# Altium project G-03T AI Board V1.0.PrjPcb
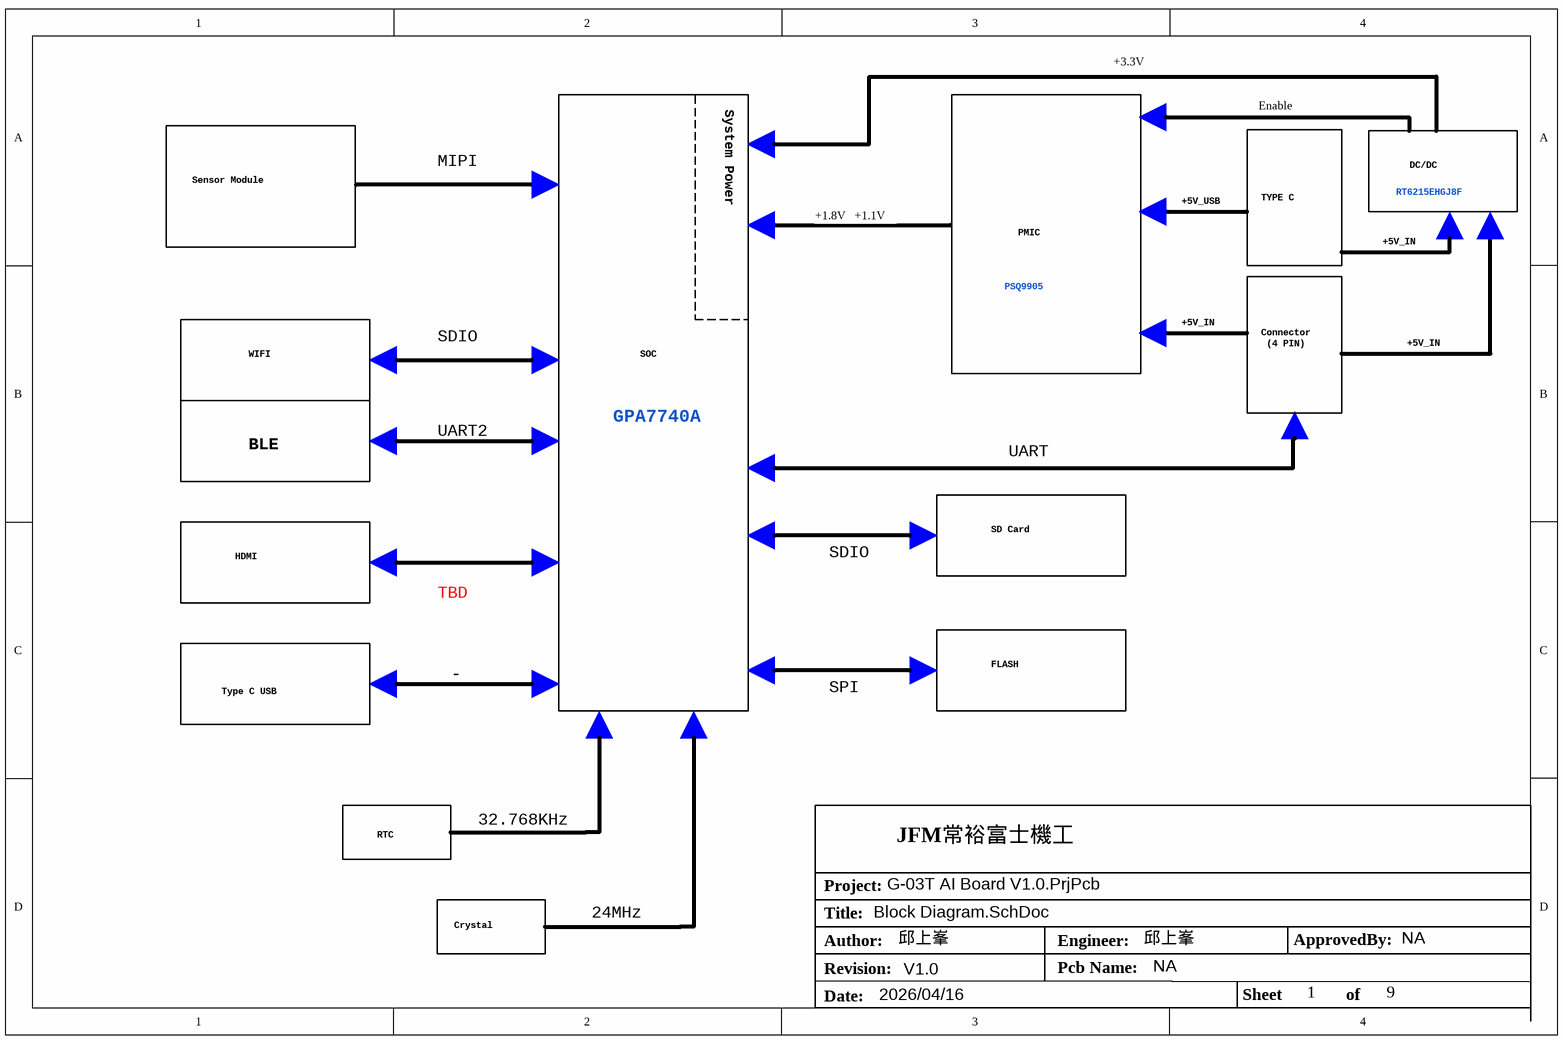
[diagram p0: Block Diagram.SchDoc]
9 sheets, 122 parts. Net scope: global (net labels, ports and power ports of the same name join across sheets).
Board file: G-03T AI Board V1.0_0416.PcbDoc
Sheets:
  Block Diagram.SchDoc
  Power Flow.SchDoc
  CPU.SchDoc
  Peripheral Interface.SchDoc
  FLASH.SchDoc
  Micro SD-Card . USB2.0.SchDoc
  Pmic.SchDoc
  DC Converter.SchDoc
  Change Note.SchDoc

## Sheet Block Diagram.SchDoc
size A4; Date: 2026/04/16; ApprovedBy: NA; Author: 邱上峯; CompanyName: JFM常裕富士機工; Engineer: 邱上峯; Revision: V1.0; SheetNumber: 1; SheetTotal: 9; Pcb Name: NA

### Notes on the sheet
- System Power
- +3.3V
- Enable
- MIPI
- Sensor Module
- +1.8V   +1.1V
- PMIC
- +5V_USB
- TYPE C
- +5V_IN
- RT6215EHGJ8F
- DC/DC
- PSQ9905
- WIFI
- SDIO
- SOC
- Connector
  (4 PIN)
- BLE
- UART2
- GPA7740A
- UART
- HDMI
- SD Card
- TBD
- Type C USB
- -
- SPI
- FLASH
- RTC
- 32.768KHz
- 24MHz
- Crystal
- Title:
- Project:
- Date:
- Author:
- Revision:
- Engineer:
- Pcb Name:
- Sheet
- ApprovedBy:
- of

## Sheet Power Flow.SchDoc
size A3; Date: 2026/04/16; ApprovedBy: NA; Author: 邱上峯; CompanyName: JFM常裕富士機工; Engineer: 邱上峯; Revision: V1.0; SheetNumber: 2; SheetTotal: 9; Pcb Name: NA
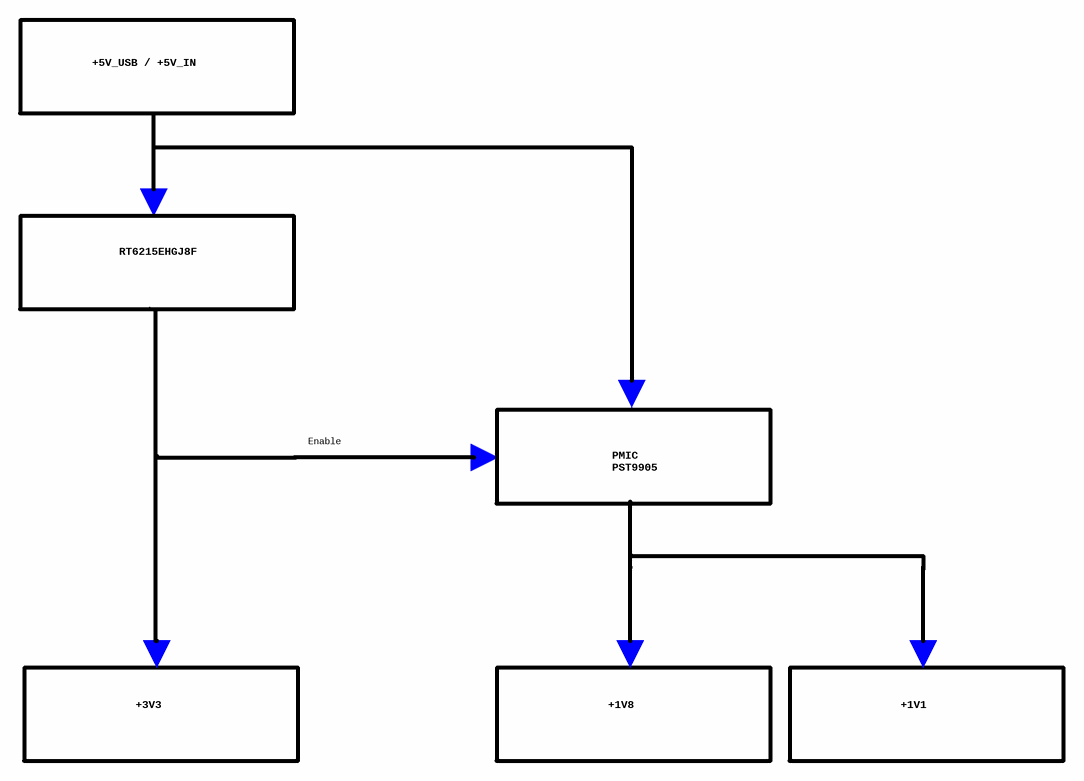
[diagram p1: Power Flow.SchDoc]

### Notes on the sheet
- +5V_USB / +5V_IN
- RT6215EHGJ8F
- Enable
- PMIC
  PST9905
- +3V3
- +1V8
- +1V1
- Title:
- Project:
- Date:
- Author:
- Revision:
- Engineer:
- Pcb Name:
- Sheet
- ApprovedBy:
- of

## Sheet CPU.SchDoc
size A3; Date: 2026/04/16; ApprovedBy: NA; Author: 邱上峯; CompanyName: JFM常裕富士機工; Engineer: 邱上峯; Revision: V1.0; SheetNumber: 2; SheetTotal: 8; Pcb Name: NA
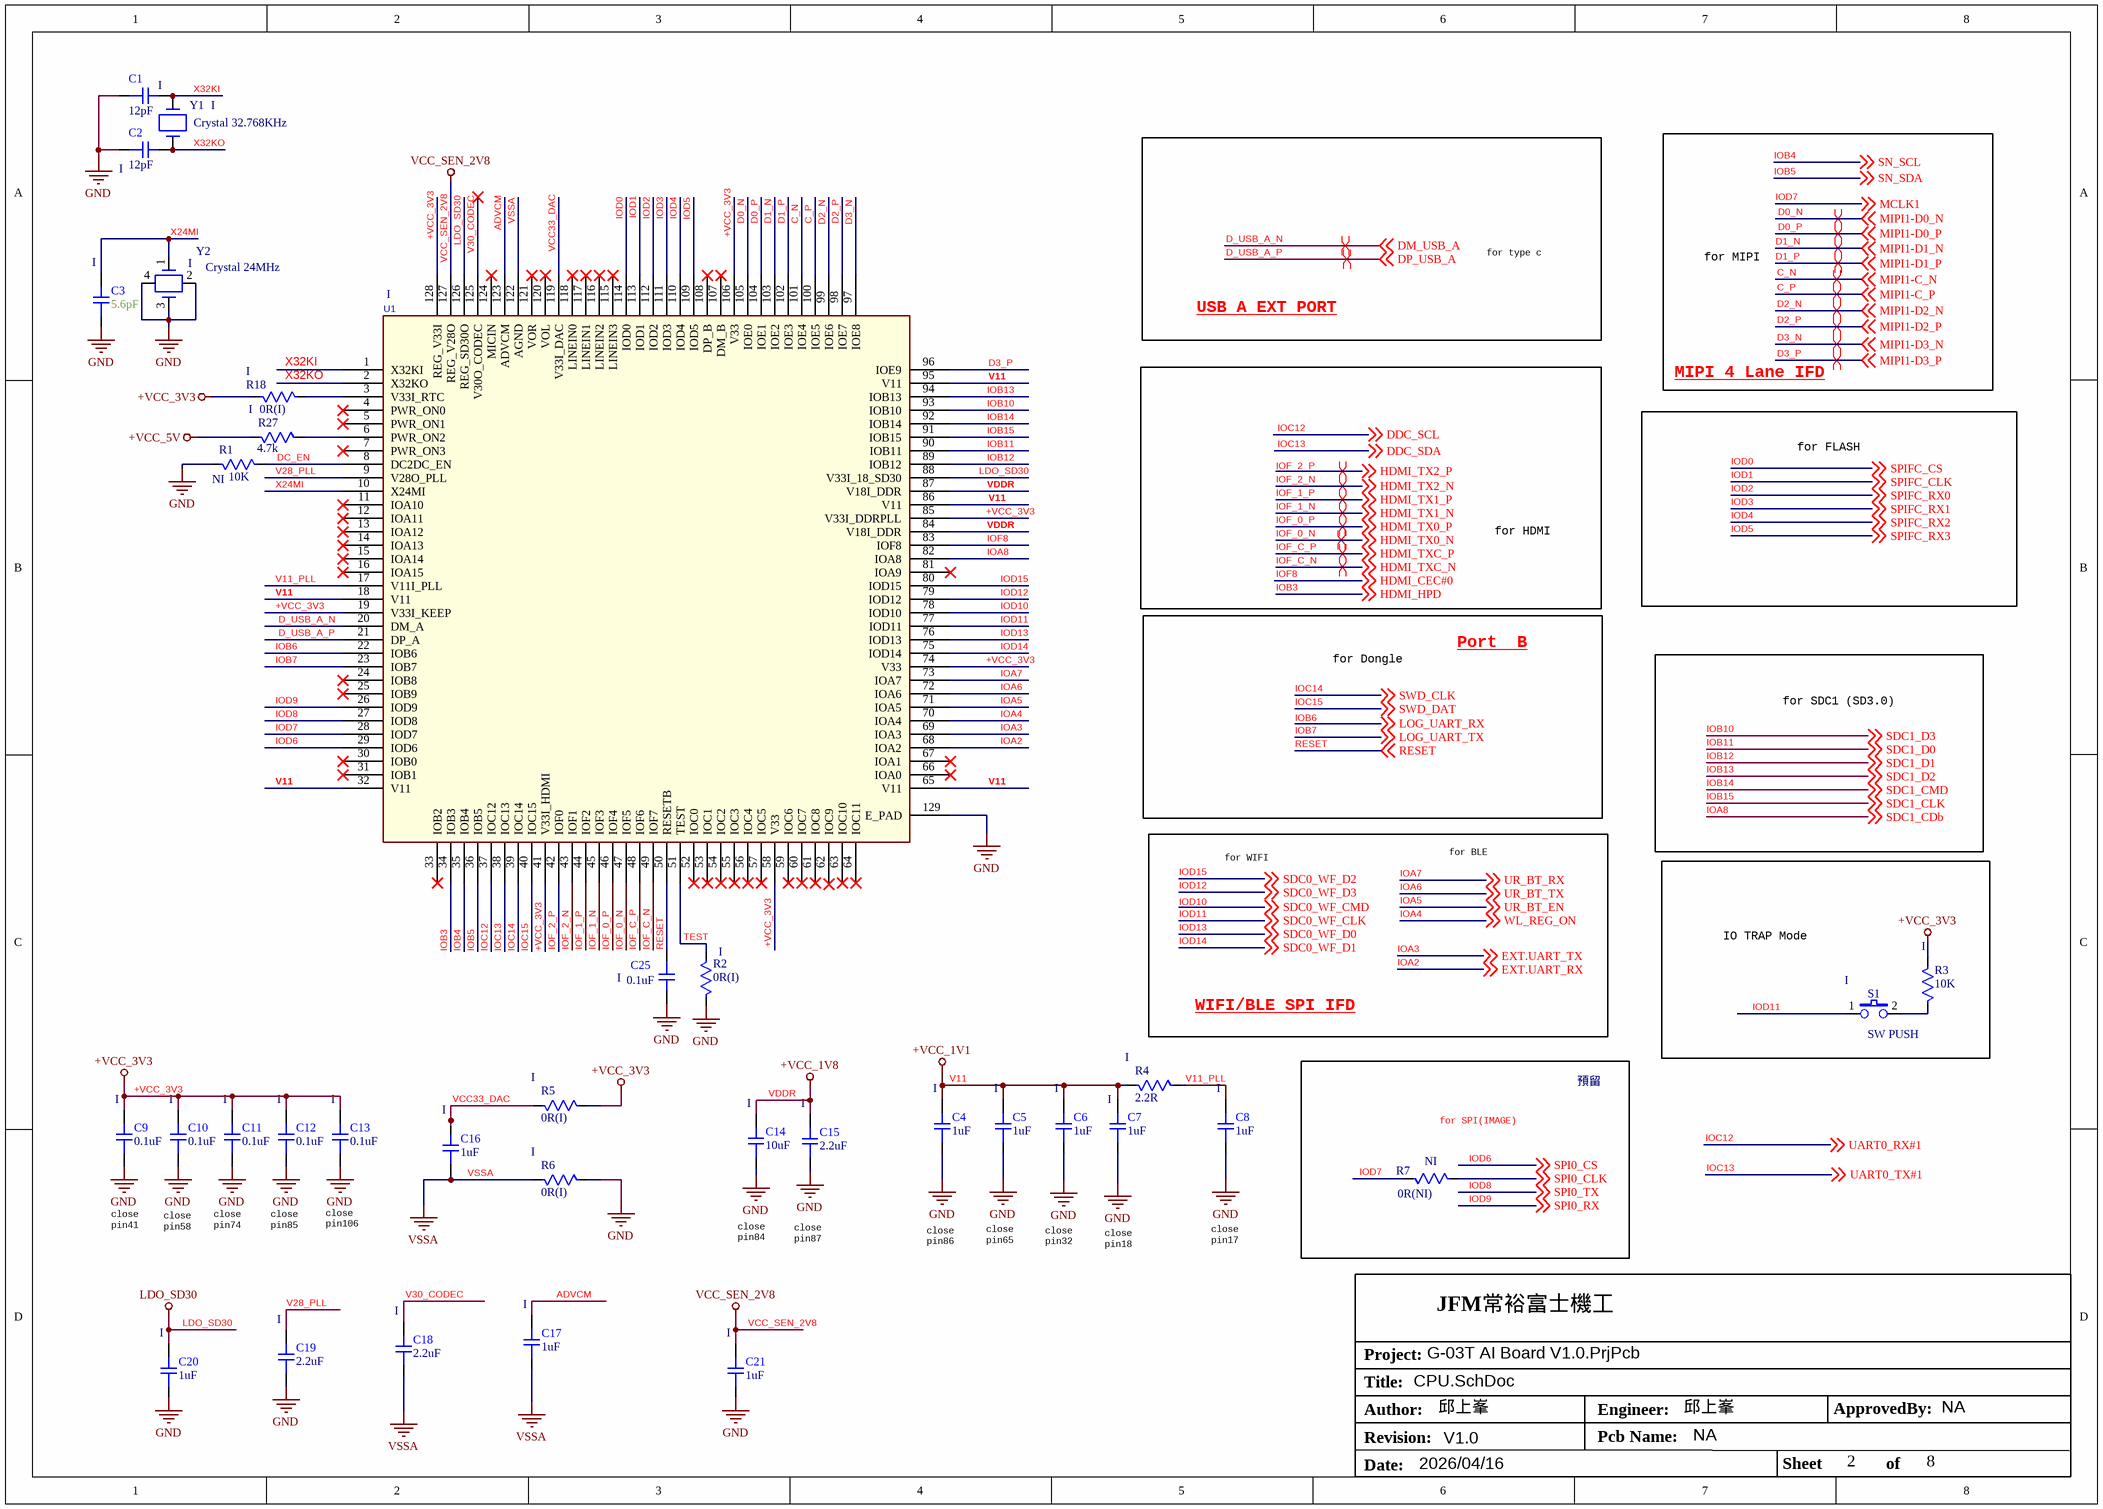
[diagram p2: CPU.SchDoc]

### Parts
C1  12pF  BOM: I  [C0402]
C2  12pF  BOM: I  [C0402]
C3  5.6pF  BOM: I  [C0402]
C4  1uF  BOM: I  [C0402]
C5  1uF  BOM: I  [C0402]
C6  1uF  BOM: I  [C0402]
C7  1uF  BOM: I  [C0402]
C8  1uF  BOM: I  [C0402]
C9  0.1uF  BOM: I  [C0402]
C10  0.1uF  BOM: I  [C0402]
C11  0.1uF  BOM: I  [C0402]
C12  0.1uF  BOM: I  [C0402]
C13  0.1uF  BOM: I  [C0402]
C14  10uF  BOM: I  [C0603]
C15  2.2uF  BOM: I  [C0402]
C16  1uF  BOM: I  [C0402]
C17  1uF  BOM: I  [C0402]
C18  2.2uF  BOM: I  [C0402]
C19  2.2uF  BOM: I  [C0402]
C20  1uF  BOM: I  [C0402]
C21  1uF  BOM: I  [C0402]
C25  0.1uF  BOM: I  [C0402]
R1  10K  BOM: NI  [R0603]
R2  0R(I)  BOM: I  [R0402]
R3  10K  BOM: I  [R0402]
R4  2.2R  BOM: I  [R0603]
R5  0R(I)  BOM: I  [R0402]
R6  0R(I)  BOM: I  [R0402]
R7  0R(NI)  BOM: NI  [R0402]
R18  0R(I)  BOM: I  [R0402]
R27  4.7k  BOM: I  [R0402]
S1  SW PUSH  BOM: I  [Surface Mount Right Angle Switch]
U1  BOM: I  [TQFP128P 1600X1600X160-129N]  (hidden comment: GPA7740A-LQFP128-EP)
Y1  Crystal 32.768KHz  BOM: I  [Crystal 32.768KHz]
Y2  Crystal 24MHz  BOM: I  [Crystal 24MHz]

### Blocks framed on the sheet
IO TRAP Mode: R3 S1
預留: R7

### Nets
+VCC_3V3: C9.2 C10.2 C11.2 C12.2 C13.2 R3.1 R5.2 R18.2 U1.19(V33I_KEEP) U1.41(V33I_HDMI) U1.58(V33) U1.74(V33) U1.85(V33I_DDRPLL) U1.106(V33) U1.128(REG_V33I)
+VCC_5V: R27.2
GND: C1.1 C2.1 C3.1 C4.1 C5.1 C6.1 C7.1 C8.1 C9.1 C10.1 C11.1 C12.1 C13.1 C14.1 C15.1 C19.1 C20.1 C21.1 C25.2 R1.2 R2.1 R6.2 U1.129(E_PAD) Y2.2 Y2.3 Y2.4
LDO_SD30: C20.2 U1.88(V33I_18_SD30) U1.126(REG_SD30O)
V11: C4.2 C5.2 C6.2 C7.2 R4.1 U1.18(V11) U1.32(V11) U1.65(V11) U1.86(V11) U1.95(V11)  [also labelled +VCC_1V1]
VCC_SEN_2V8: C21.2 U1.127(REG_V28O)
VDDR: C14.2 C15.2 U1.84(V18I_DDR) U1.87(V18I_DDR)  [also labelled +VCC_1V8]
VSSA: C16.1 C17.1 C18.1 R6.1 U1.122(AGND)
ADVCM: C17.2 U1.123(ADVCM)
C_N: U1.101(IOE4) ; off-sheet MIPI1-C_N  [also labelled MIPI1-C_N]
C_P: U1.100(IOE5) ; off-sheet MIPI1-C_P  [also labelled MIPI1-C_P]
D0_N: U1.105(IOE0) ; off-sheet MIPI1-D0_N  [also labelled MIPI1-D0_N]
D0_P: U1.104(IOE1) ; off-sheet MIPI1-D0_P  [also labelled MIPI1-D0_P]
D1_N: U1.103(IOE2) ; off-sheet MIPI1-D1_N  [also labelled MIPI1-D1_N]
D1_P: U1.102(IOE3) ; off-sheet MIPI1-D1_P  [also labelled MIPI1-D1_P]
D2_N: U1.99(IOE6) ; off-sheet MIPI1-D2_N  [also labelled MIPI1-D2_N]
D2_P: U1.98(IOE7) ; off-sheet MIPI1-D2_P  [also labelled MIPI1-D2_P]
D3_N: U1.97(IOE8) ; off-sheet MIPI1-D3_N  [also labelled MIPI1-D3_N]
D3_P: U1.96(IOE9) ; off-sheet MIPI1-D3_P  [also labelled MIPI1-D3_P]
D_USB_A_N: U1.20(DM_A) ; off-sheet DM_USB_A  [also labelled DM_USB_A]
D_USB_A_P: U1.21(DP_A) ; off-sheet DP_USB_A  [also labelled DP_USB_A]
DC_EN: R1.1 U1.8(DC2DC_EN)
IOA2: U1.68(IOA2) ; off-sheet EXT.UART_RX  [also labelled EXT.UART_RX]
IOA3: U1.69(IOA3) ; off-sheet EXT.UART_TX  [also labelled EXT.UART_TX]
IOA4: U1.70(IOA4) ; off-sheet WL_REG_ON  [also labelled WL_REG_ON]
IOA5: U1.71(IOA5) ; off-sheet UR_BT_EN  [also labelled UR_BT_EN]
IOA6: U1.72(IOA6) ; off-sheet UR_BT_TX  [also labelled UR_BT_TX]
IOA7: U1.73(IOA7) ; off-sheet UR_BT_RX  [also labelled UR_BT_RX]
IOA8: U1.82(IOA8) ; off-sheet SDC1_CDb  [also labelled SDC1_CDb]
IOB3: U1.34(IOB3) ; off-sheet HDMI_HPD  [also labelled HDMI_HPD]
IOB4: U1.35(IOB4) ; off-sheet SN_SCL  [also labelled SN_SCL]
IOB5: U1.36(IOB5) ; off-sheet SN_SDA  [also labelled SN_SDA]
IOB6: U1.22(IOB6) ; off-sheet LOG_UART_RX  [also labelled LOG_UART_RX]
IOB7: U1.23(IOB7) ; off-sheet LOG_UART_TX  [also labelled LOG_UART_TX]
IOB10: U1.93(IOB10) ; off-sheet SDC1_D3  [also labelled SDC1_D3]
IOB11: U1.90(IOB11) ; off-sheet SDC1_D0  [also labelled SDC1_D0]
IOB12: U1.89(IOB12) ; off-sheet SDC1_D1  [also labelled SDC1_D1]
IOB13: U1.94(IOB13) ; off-sheet SDC1_D2  [also labelled SDC1_D2]
IOB14: U1.92(IOB14) ; off-sheet SDC1_CMD  [also labelled SDC1_CMD]
IOB15: U1.91(IOB15) ; off-sheet SDC1_CLK  [also labelled SDC1_CLK]
IOC12: U1.37(IOC12) ; off-sheet DDC_SCL, off-sheet UART0_RX#1  [also labelled DDC_SCL, UART0_RX#1]
IOC13: U1.38(IOC13) ; off-sheet DDC_SDA, off-sheet UART0_TX#1  [also labelled DDC_SDA, UART0_TX#1]
IOC14: U1.39(IOC14) ; off-sheet SWD_CLK  [also labelled SWD_CLK]
IOC15: U1.40(IOC15) ; off-sheet SWD_DAT  [also labelled SWD_DAT]
IOD0: U1.114(IOD0) ; off-sheet SPIFC_CS  [also labelled SPIFC_CS]
IOD1: U1.113(IOD1) ; off-sheet SPIFC_CLK  [also labelled SPIFC_CLK]
IOD2: U1.112(IOD2) ; off-sheet SPIFC_RX0  [also labelled SPIFC_RX0]
IOD3: U1.111(IOD3) ; off-sheet SPIFC_RX1  [also labelled SPIFC_RX1]
IOD4: U1.110(IOD4) ; off-sheet SPIFC_RX2  [also labelled SPIFC_RX2]
IOD5: U1.109(IOD5) ; off-sheet SPIFC_RX3  [also labelled SPIFC_RX3]
IOD6: U1.29(IOD6) ; off-sheet SPI0_CS  [also labelled SPI0_CS]
IOD7: R7.1 U1.28(IOD7) ; off-sheet MCLK1  [also labelled MCLK1]
IOD8: U1.27(IOD8) ; off-sheet SPI0_TX  [also labelled SPI0_TX]
IOD9: U1.26(IOD9) ; off-sheet SPI0_RX  [also labelled SPI0_RX]
IOD10: U1.78(IOD10) ; off-sheet SDC0_WF_CMD  [also labelled SDC0_WF_CMD]
IOD11: S1.1 U1.77(IOD11) ; off-sheet SDC0_WF_CLK  [also labelled SDC0_WF_CLK]
IOD12: U1.79(IOD12) ; off-sheet SDC0_WF_D3  [also labelled SDC0_WF_D3]
IOD13: U1.76(IOD13) ; off-sheet SDC0_WF_D0  [also labelled SDC0_WF_D0]
IOD14: U1.75(IOD14) ; off-sheet SDC0_WF_D1  [also labelled SDC0_WF_D1]
IOD15: U1.80(IOD15) ; off-sheet SDC0_WF_D2  [also labelled SDC0_WF_D2]
IOF8: U1.83(IOF8) ; off-sheet HDMI_CEC#0  [also labelled HDMI_CEC#0]
IOF_0_N: U1.47(IOF5) ; off-sheet HDMI_TX0_N  [also labelled HDMI_TX0_N]
IOF_0_P: U1.46(IOF4) ; off-sheet HDMI_TX0_P  [also labelled HDMI_TX0_P]
IOF_1_N: U1.45(IOF3) ; off-sheet HDMI_TX1_N  [also labelled HDMI_TX1_N]
IOF_1_P: U1.44(IOF2) ; off-sheet HDMI_TX1_P  [also labelled HDMI_TX1_P]
IOF_2_N: U1.43(IOF1) ; off-sheet HDMI_TX2_N  [also labelled HDMI_TX2_N]
IOF_2_P: U1.42(IOF0) ; off-sheet HDMI_TX2_P  [also labelled HDMI_TX2_P]
IOF_C_N: U1.49(IOF7) ; off-sheet HDMI_TXC_N  [also labelled HDMI_TXC_N]
IOF_C_P: U1.48(IOF6) ; off-sheet HDMI_TXC_P  [also labelled HDMI_TXC_P]
RESET: C25.1 U1.50(RESETB) ; off-sheet RESET
SPI0_CLK: R7.2 ; off-sheet SPI0_CLK
TEST: R2.2 U1.51(TEST)
V11_PLL: C8.2 R4.2 U1.17(V11I_PLL)
V28_PLL: C19.2 U1.9(V28O_PLL)
V30_CODEC: C18.2 U1.125(V30O_CODEC)
VCC33_DAC: C16.2 R5.1 U1.119(V33I_DAC)
X24MI: C3.2 U1.10(X24MI) Y2.1
X32KI: C1.2 U1.1(X32KI) Y1.2
X32KO: C2.2 U1.2(X32KO) Y1.1
NetR3_2: R3.2 S1.2
NetR18_1: R18.1 U1.3(V33I_RTC)
NetR27_1: R27.1 U1.6(PWR_ON2)

Not connected (* = marked no-connect by the designer): U1 4(PWR_ON0)* 5(PWR_ON1)* 7(PWR_ON3)* 11(IOA10)* 12(IOA11)* 13(IOA12)* 14(IOA13)* 15(IOA14)* 16(IOA15)* 24(IOB8)* 25(IOB9)* 30(IOB0)* 31(IOB1)* 33(IOB2)* 52(IOC0)* 53(IOC1)* 54(IOC2)* 55(IOC3)* 56(IOC4)* 57(IOC5)* 59(IOC6)* 60(IOC7)* 61(IOC8)* 62(IOC9) 63(IOC10)* 64(IOC11)* 66(IOA0)* 67(IOA1)* 81(IOA9)* 107(DM_B)* 108(DP_B)* 115(LINEIN3)* 116(LINEIN2)* 117(LINEIN1)* 118(LINEIN0)* 120(VOL)* 121(VOR)* 124(MICIN)*

### Layout directives
differential pair: C_N, C_P, D0_N, D0_P, D1_N, D1_P, D2_N, D2_P, D3_N, D3_P, D_USB_A_N, D_USB_A_P, IOF_0_N, IOF_0_P, IOF_1_N, IOF_1_P, IOF_2_N, IOF_2_P, IOF_C_N, IOF_C_P

### Notes on the sheet
- USB A EXT PORT
- for type c
- for MIPI
- MIPI 4 Lane IFD
- for FLASH
- for HDMI
- Port  B
- for Dongle
- for SDC1 (SD3.0)
- for BLE
- for WIFI
- WIFI/BLE SPI IFD
- (near R7) for SPI(IMAGE)
- close
  pin41
- close
  pin58
- close
  pin74
- close
  pin85
- close
  pin106
- close
  pin84
- close
  pin87
- close
  pin86
- close
  pin65
- close
  pin32
- close
  pin18
- close
  pin17
- Labels drawn without touching a wire or pin: IOB6, IOD10, IOF_2_P
- Title:
- Project:
- Date:
- Author:
- Revision:
- Engineer:
- Pcb Name:
- Sheet
- ApprovedBy:
- of

### Library data of the parts
C1-C21 C25 = Cap
R1-R7 R18 R27 = Res
Y1 = Crystal 32.768KHz: Q-SC20S03220C5AAAF,SEIKO,l32.768KHz,12.5PF,20ppm,2.05x1.2mm
Y2 = Crystal 24MHz: XRCGE24M000FBA1BR0,MURATA,24.0000MHZ,8PF,15PPM,2.0x1.6mm

## Sheet Peripheral Interface.SchDoc
size A3; Date: 2026/04/16; ApprovedBy: NA; Author: 邱上峯; CompanyName: JFM常裕富士機工; Engineer: 邱上峯; Revision: V1.0; SheetNumber: 3; SheetTotal: 8; Pcb Name: NA
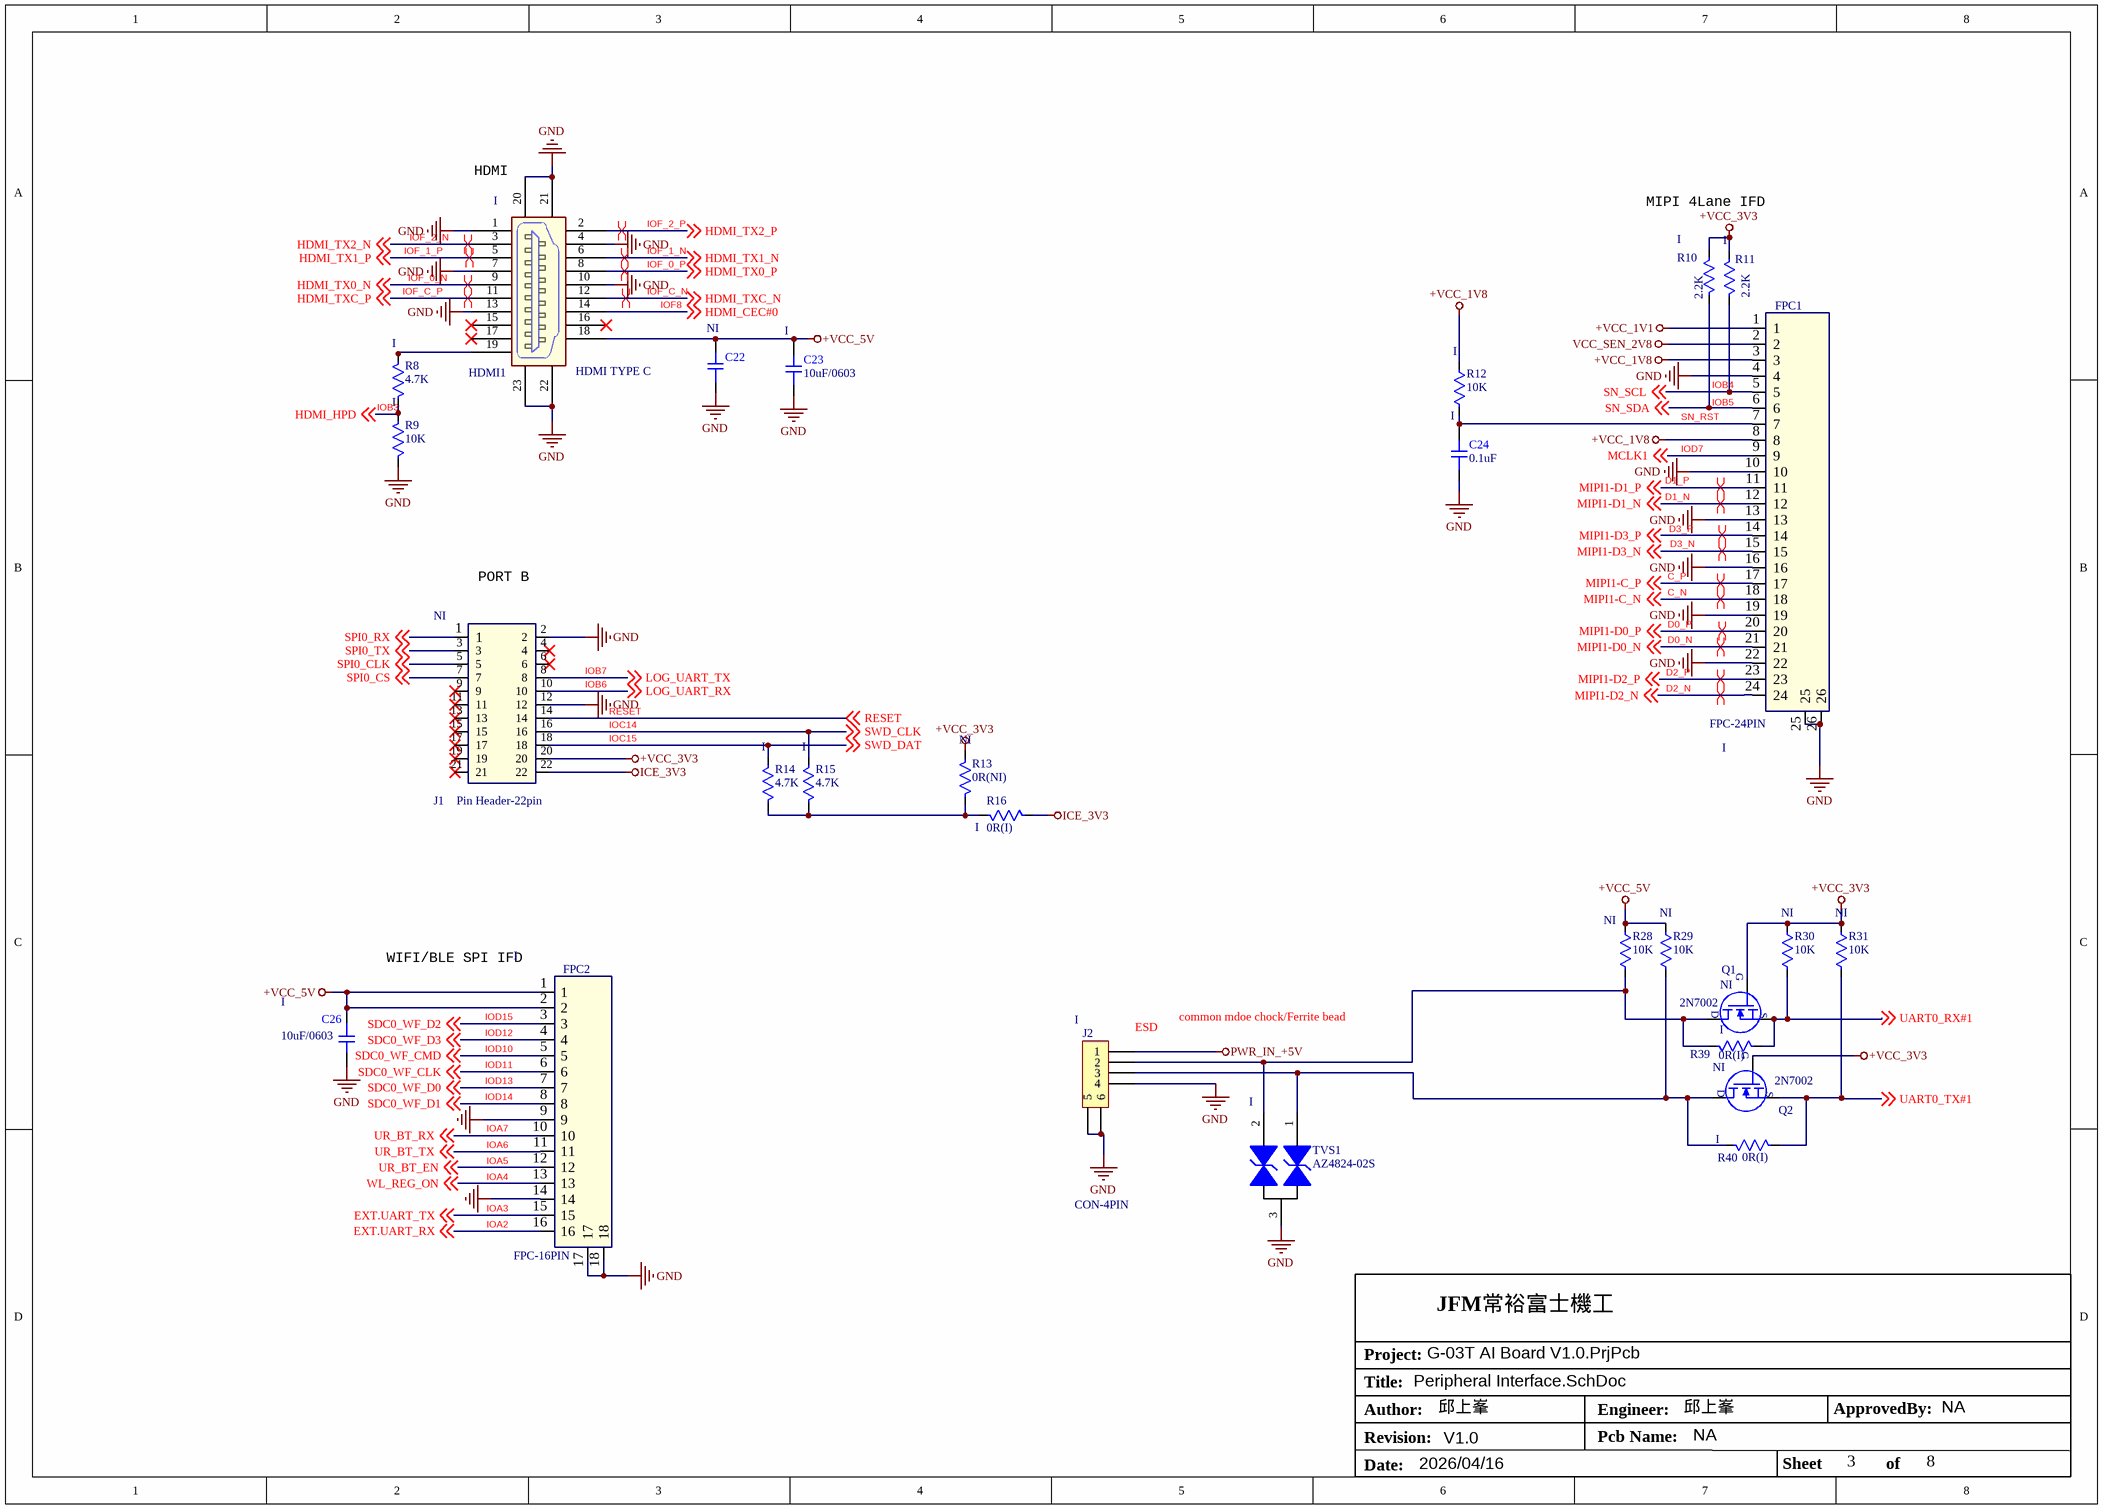
[diagram p3: Peripheral Interface.SchDoc]

### Parts
C22  NI  [C0402]
C23  10uF/0603  BOM: I  [C0603]
C24  0.1uF  BOM: I  [C0402]
C26  10uF/0603  BOM: I  [C0603]
FPC1  FPC-24PIN  BOM: I  [FPC-0.5 pitch 24PIN]
FPC2  FPC-16PIN  BOM: I  [FPC-0.5 pitch 16PIN]
HDMI1  HDMI TYPE C  BOM: I  [HDMI TYPE C]
J1  Pin Header-22pin  BOM: NI  [1.27mm Pin Header Through Hole-22P]
J2  CON-4PIN  BOM: I  [P20M2I-04SMT]
Q1  2N7002  BOM: NI  [SMD-SOT-23]
Q2  2N7002  BOM: NI  [SMD-SOT-23]
R8  4.7K  BOM: I  [R0402]
R9  10K  BOM: I  [R0402]
R10  2.2K  BOM: I  [R0603]
R11  2.2K  BOM: I  [R0603]
R12  10K  BOM: I  [R0402]
R13  0R(NI)  BOM: NI  [R0402]
R14  4.7K  BOM: I  [R0402]
R15  4.7K  BOM: I  [R0402]
R16  0R(I)  BOM: I  [R0402]
R28  10K  BOM: NI  [R0402]
R29  10K  BOM: NI  [R0402]
R30  10K  BOM: NI  [R0402]
R31  10K  BOM: NI  [R0402]
R39  0R(I)  BOM: I  [R0402]
R40  0R(I)  BOM: I  [R0402]
TVS1  AZ4824-02S  BOM: I  [SOT-23-3L]

### Nets
+VCC_1V1: FPC1.1  [project net V11]
+VCC_1V8: FPC1.3 FPC1.8 R12.2  [project net VDDR]
+VCC_3V3: J1.20 Q1.1(G) Q2.1(G) R10.2 R11.2 R13.1 R30.1 R31.1
+VCC_5V: C22.2 C23.2 C26.1 FPC2.1 FPC2.2 HDMI1.18 R28.1 R29.1
GND: C22.1 C23.1 C24.1 C26.2 FPC1.4 FPC1.10 FPC1.13 FPC1.16 FPC1.19 FPC1.22 FPC1.25 FPC1.26 FPC2.9 FPC2.14 FPC2.17 FPC2.18 HDMI1.1($PIN0) HDMI1.4 HDMI1.7 HDMI1.10 HDMI1.13 HDMI1.20 HDMI1.21 HDMI1.22 HDMI1.23 J1.2 J1.12 J2.4 J2.5 J2.6 R9.1 TVS1.3
ICE_3V3: J1.22 R16.2
PWR_IN_+5V: J2.1
VCC_SEN_2V8: FPC1.2
C_N: FPC1.18 ; off-sheet MIPI1-C_N  [also labelled MIPI1-C_N]
C_P: FPC1.17 ; off-sheet MIPI1-C_P  [also labelled MIPI1-C_P]
D0_N: FPC1.21 ; off-sheet MIPI1-D0_N  [also labelled MIPI1-D0_N]
D0_P: FPC1.20 ; off-sheet MIPI1-D0_P  [also labelled MIPI1-D0_P]
D1_N: FPC1.12 ; off-sheet MIPI1-D1_N  [also labelled MIPI1-D1_N]
D1_P: FPC1.11 ; off-sheet MIPI1-D1_P  [also labelled MIPI1-D1_P]
D2_N: FPC1.24 ; off-sheet MIPI1-D2_N  [also labelled MIPI1-D2_N]
D2_P: FPC1.23 ; off-sheet MIPI1-D2_P  [also labelled MIPI1-D2_P]
D3_N: FPC1.15 ; off-sheet MIPI1-D3_N  [also labelled MIPI1-D3_N]
IOA2: FPC2.16 ; off-sheet EXT.UART_RX  [also labelled EXT.UART_RX]
IOA3: FPC2.15 ; off-sheet EXT.UART_TX  [also labelled EXT.UART_TX]
IOA5: FPC2.12 ; off-sheet UR_BT_EN  [also labelled UR_BT_EN]
IOA6: FPC2.11 ; off-sheet UR_BT_TX  [also labelled UR_BT_TX]
IOA7: FPC2.10 ; off-sheet UR_BT_RX  [also labelled UR_BT_RX]
IOB3: R8.1 R9.2 ; off-sheet HDMI_HPD  [also labelled HDMI_HPD]
IOB4: FPC1.5 R11.1 ; off-sheet SN_SCL  [also labelled SN_SCL]
IOB6: J1.10 ; off-sheet LOG_UART_RX  [also labelled LOG_UART_RX]
IOB7: J1.8 ; off-sheet LOG_UART_TX  [also labelled LOG_UART_TX]
IOC14: J1.16 R15.2 ; off-sheet SWD_CLK  [also labelled SWD_CLK]
IOC15: J1.18 R14.2 ; off-sheet SWD_DAT  [also labelled SWD_DAT]
IOD7: FPC1.9 ; off-sheet MCLK1  [also labelled MCLK1]
IOD10: FPC2.5 ; off-sheet SDC0_WF_CMD  [also labelled SDC0_WF_CMD]
IOD11: FPC2.6 ; off-sheet SDC0_WF_CLK  [also labelled SDC0_WF_CLK]
IOD12: FPC2.4 ; off-sheet SDC0_WF_D3  [also labelled SDC0_WF_D3]
IOD13: FPC2.7 ; off-sheet SDC0_WF_D0  [also labelled SDC0_WF_D0]
IOD14: FPC2.8 ; off-sheet SDC0_WF_D1  [also labelled SDC0_WF_D1]
IOD15: FPC2.3 ; off-sheet SDC0_WF_D2  [also labelled SDC0_WF_D2]
IOF8: HDMI1.14 ; off-sheet HDMI_CEC#0  [also labelled HDMI_CEC#0]
IOF_0_N: HDMI1.9 ; off-sheet HDMI_TX0_N  [also labelled HDMI_TX0_N]
IOF_0_P: HDMI1.8 ; off-sheet HDMI_TX0_P  [also labelled HDMI_TX0_P]
IOF_1_N: HDMI1.6 ; off-sheet HDMI_TX1_N  [also labelled HDMI_TX1_N]
IOF_1_P: HDMI1.5 ; off-sheet HDMI_TX1_P  [also labelled HDMI_TX1_P]
IOF_2_N: HDMI1.3 ; off-sheet HDMI_TX2_N  [also labelled HDMI_TX2_N]
IOF_2_P: HDMI1.2 ; off-sheet HDMI_TX2_P  [also labelled HDMI_TX2_P]
IOF_C_N: HDMI1.12 ; off-sheet HDMI_TXC_N  [also labelled HDMI_TXC_N]
IOF_C_P: HDMI1.11 ; off-sheet HDMI_TXC_P  [also labelled HDMI_TXC_P]
MIPI1-D3_P: FPC1.14 ; off-sheet MIPI1-D3_P  [project net D3_P]
RESET: J1.14 ; off-sheet RESET
SN_RST: C24.2 FPC1.7 R12.1
SN_SDA: FPC1.6 R10.1 ; off-sheet SN_SDA  [project net IOB5]
SPI0_CLK: J1.5 ; off-sheet SPI0_CLK
SPI0_CS: J1.7 ; off-sheet SPI0_CS  [project net IOD6]
SPI0_RX: J1.1 ; off-sheet SPI0_RX  [project net IOD9]
SPI0_TX: J1.3 ; off-sheet SPI0_TX  [project net IOD8]
UART0_RX#1: Q1.2(S) R30.2 R39.1 ; off-sheet UART0_RX#1  [project net IOC12]
UART0_TX#1: Q2.2(S) R31.2 R40.1 ; off-sheet UART0_TX#1  [project net IOC13]
WL_REG_ON: FPC2.13 ; off-sheet WL_REG_ON  [project net IOA4]
NetHDMI1_19: HDMI1.19 R8.2
NetJ2_2: J2.2 Q1.3(D) R28.2 R39.2 TVS1.2(K)
NetJ2_3: J2.3 Q2.3(D) R29.2 R40.2 TVS1.1(A)
NetR13_2: R13.2 R14.1 R15.1 R16.1

Not connected (* = marked no-connect by the designer): HDMI1 15* 16* 17*; J1 4* 6* 9* 11* 13* 15* 17* 19* 21*

### Layout directives
differential pair: (no net found under the mark), C_N, C_P, D0_N, D0_P, D1_N, D1_P, D2_N, D2_P, D3_N, IOF_0_N, IOF_0_P, IOF_1_N, IOF_1_P, IOF_2_N, IOF_C_N, IOF_C_P

### Notes on the sheet
- (near HDMI1) HDMI
- MIPI 4Lane IFD
- (near J1) PORT B
- WIFI/BLE SPI IFD
- (near J2) ESD
- common mdoe chock/Ferrite bead
- Labels drawn without touching a wire or pin: D3_P, IOA4, IOB5
- Title:
- Project:
- Date:
- Author:
- Revision:
- Engineer:
- Pcb Name:
- Sheet
- ApprovedBy:
- of

### Library data of the parts
C22 = Cap: 0.1uF/0603; BOM: NI
C23 C24 C26 = Cap
FPC1 = FPC-24PIN: MIPI FPC-24PIN
FPC2 = FPC-16PIN: WIFI/BLE  FPC-16PIN
HDMI1 = HDMI TYPE D/C
J1 = 1.27mm Pin Header Through Hole22P: 1.27mm Pin Header Through Hole-22P
Q1 Q2 = NMOS-2N7002: MOSFET N-CHANNEL 60V 115mA
R8-R12 R14 R15 R28-R31 R39 R40 = Res
R13 R16 = Res: 0R
TVS1 = TVS_AZ4824-02S

## Sheet FLASH.SchDoc
size A4; Date: 2026/04/16; ApprovedBy: NA; Author: 邱上峯; CompanyName: JFM常裕富士機工; Engineer: 邱上峯; Revision: V1.0; SheetNumber: 4; SheetTotal: 8; Pcb Name: NA
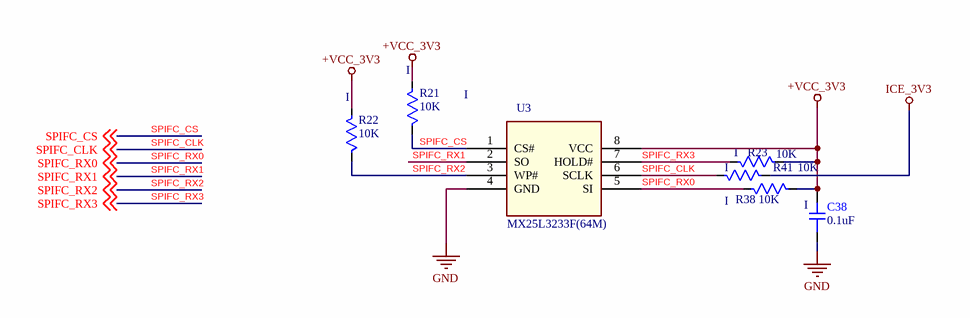
[diagram p4: FLASH.SchDoc]

### Parts
C38  0.1uF  BOM: I  [C0402]
R21  10K  BOM: I  [R0402]
R22  10K  BOM: I  [R0402]
R23  10K  BOM: I  [R0402]
R38  10K  BOM: I  [R0402]
R41  10K  BOM: I  [R0402]
U3  MX25L3233F(64M)  BOM: I  [SOIC127P790X216-8N(MX25L3233F)]

### Nets
+VCC_3V3: C38.2 R21.2 R22.2 R23.1 R38.1 U3.8(VCC)
GND: C38.1 U3.4(GND)
ICE_3V3: R41.1
SPIFC_CLK: R41.2 U3.6(SCLK) ; off-sheet SPIFC_CLK  [project net IOD1]
SPIFC_CS: R21.1 U3.1(CS#) ; off-sheet SPIFC_CS  [project net IOD0]
SPIFC_RX0: R38.2 U3.5(SI) ; off-sheet SPIFC_RX0  [project net IOD2]
SPIFC_RX1: U3.2(SO) ; off-sheet SPIFC_RX1  [project net IOD3]
SPIFC_RX2: R22.1 U3.3(WP#) ; off-sheet SPIFC_RX2  [project net IOD4]
SPIFC_RX3: R23.2 U3.7(HOLD#) ; off-sheet SPIFC_RX3  [project net IOD5]

### Notes on the sheet
- Title:
- Project:
- Date:
- Author:
- Revision:
- Engineer:
- Pcb Name:
- Sheet
- ApprovedBy:
- of

### Library data of the parts
C38 = Cap
R21-R23 R38 R41 = Res
U3 = SOP-8: MX25L3233F(32M)

## Sheet Micro SD-Card . USB2.0.SchDoc
size A4; Date: 2026/04/16; ApprovedBy: NA; Author: 邱上峯; CompanyName: JFM常裕富士機工; Engineer: 邱上峯; Revision: V1.0; SheetNumber: 5; SheetTotal: 8; Pcb Name: NA
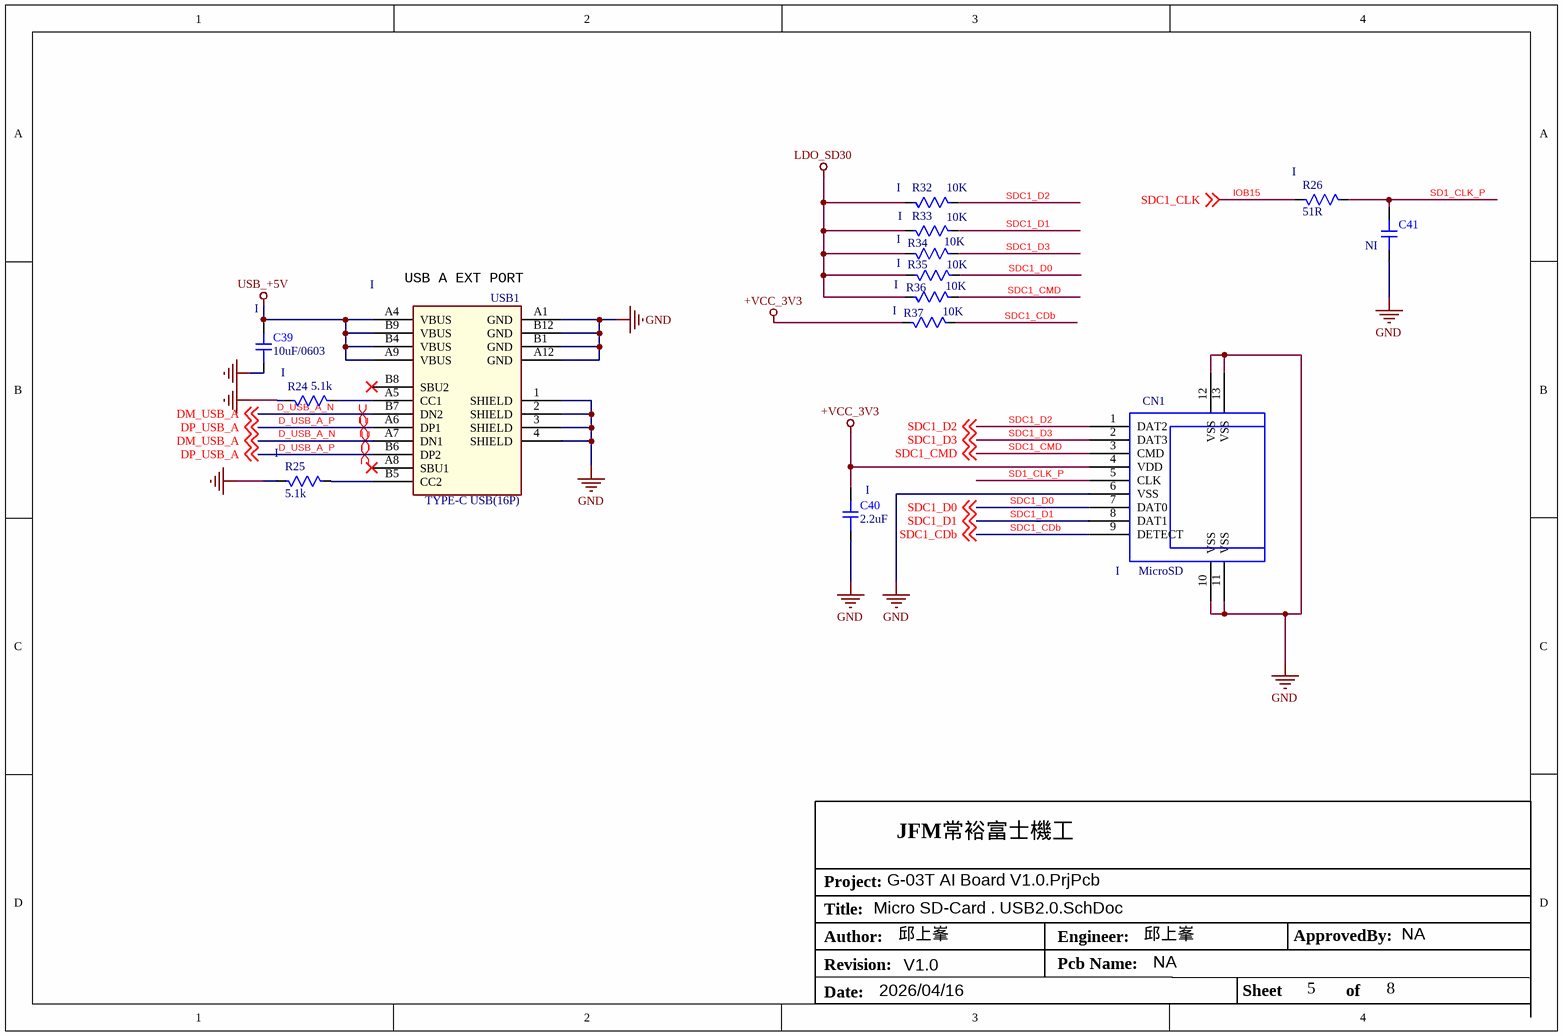
[diagram p5: Micro SD-Card . USB2.0.SchDoc]

### Parts
C39  10uF/0603  BOM: I  [C0603]
C40  2.2uF  BOM: I  [C0402]
C41  NI  [C0402]
CN1  MicroSD  BOM: I  [MicroSD]
R24  5.1k  BOM: I  [R0603]
R25  5.1k  BOM: I  [R0603]
R26  51R  BOM: I  [R0603]
R32  10K  BOM: I  [R0402]
R33  10K  BOM: I  [R0402]
R34  10K  BOM: I  [R0402]
R35  10K  BOM: I  [R0402]
R36  10K  BOM: I  [R0402]
R37  10K  BOM: I  [R0402]
USB1  TYPE-C USB(16P)  BOM: I  [Type C USB (16P)]

### Nets
+VCC_3V3: C40.2 CN1.4(VDD) R37.1
GND: C39.1 C40.1 C41.1 CN1.6(VSS) CN1.10(VSS) CN1.11(VSS) CN1.12(VSS) CN1.13(VSS) R24.1 R25.1 USB1.1(SHIELD) USB1.2(SHIELD) USB1.3(SHIELD) USB1.4(SHIELD) USB1.A1(GND) USB1.A12(GND) USB1.B1(GND) USB1.B12(GND)
LDO_SD30: R32.1 R33.1 R34.1 R35.1 R36.1
USB_+5V: C39.2 USB1.A4(VBUS) USB1.A9(VBUS) USB1.B4(VBUS) USB1.B9(VBUS)
D_USB_A_N: USB1.A7(DN1) USB1.B7(DN2) ; off-sheet DM_USB_A  [also labelled DM_USB_A]
D_USB_A_P: USB1.A6(DP1) USB1.B6(DP2) ; off-sheet DP_USB_A  [also labelled DP_USB_A]
IOB15: R26.1 ; off-sheet SDC1_CLK  [also labelled SDC1_CLK]
SD1_CLK_P: C41.2 CN1.5(CLK) R26.2
SDC1_CDb: CN1.9(DETECT) R37.2 ; off-sheet SDC1_CDb  [project net IOA8]
SDC1_CMD: CN1.3(CMD) R36.2 ; off-sheet SDC1_CMD  [project net IOB14]
SDC1_D0: CN1.7(DAT0) R35.2 ; off-sheet SDC1_D0  [project net IOB11]
SDC1_D1: CN1.8(DAT1) R33.2 ; off-sheet SDC1_D1  [project net IOB12]
SDC1_D2: CN1.1(DAT2) R32.2 ; off-sheet SDC1_D2  [project net IOB13]
SDC1_D3: CN1.2(DAT3) R34.2 ; off-sheet SDC1_D3  [project net IOB10]
NetR24_2: R24.2 USB1.A5(CC1)
NetR25_2: R25.2 USB1.B5(CC2)

Not connected (* = marked no-connect by the designer): USB1 A8(SBU1) B8(SBU2)

### Layout directives
differential pair: D_USB_A_N, D_USB_A_P

### Notes on the sheet
- (near USB1) USB A EXT PORT
- Title:
- Project:
- Date:
- Author:
- Revision:
- Engineer:
- Pcb Name:
- Sheet
- ApprovedBy:
- of

### Library data of the parts
C39-C41 = Cap
  C41: BOM: NI
R24-R26 R32-R37 = Res
USB1 = TYPE-C USB_1: CUC006AHP-BPIN

## Sheet Pmic.SchDoc
size A4; Date: 2026/04/16; ApprovedBy: NA; Author: 邱上峯; CompanyName: JFM常裕富士機工; Engineer: 邱上峯; Revision: V1.0; SheetNumber: 6; SheetTotal: 8; Pcb Name: NA
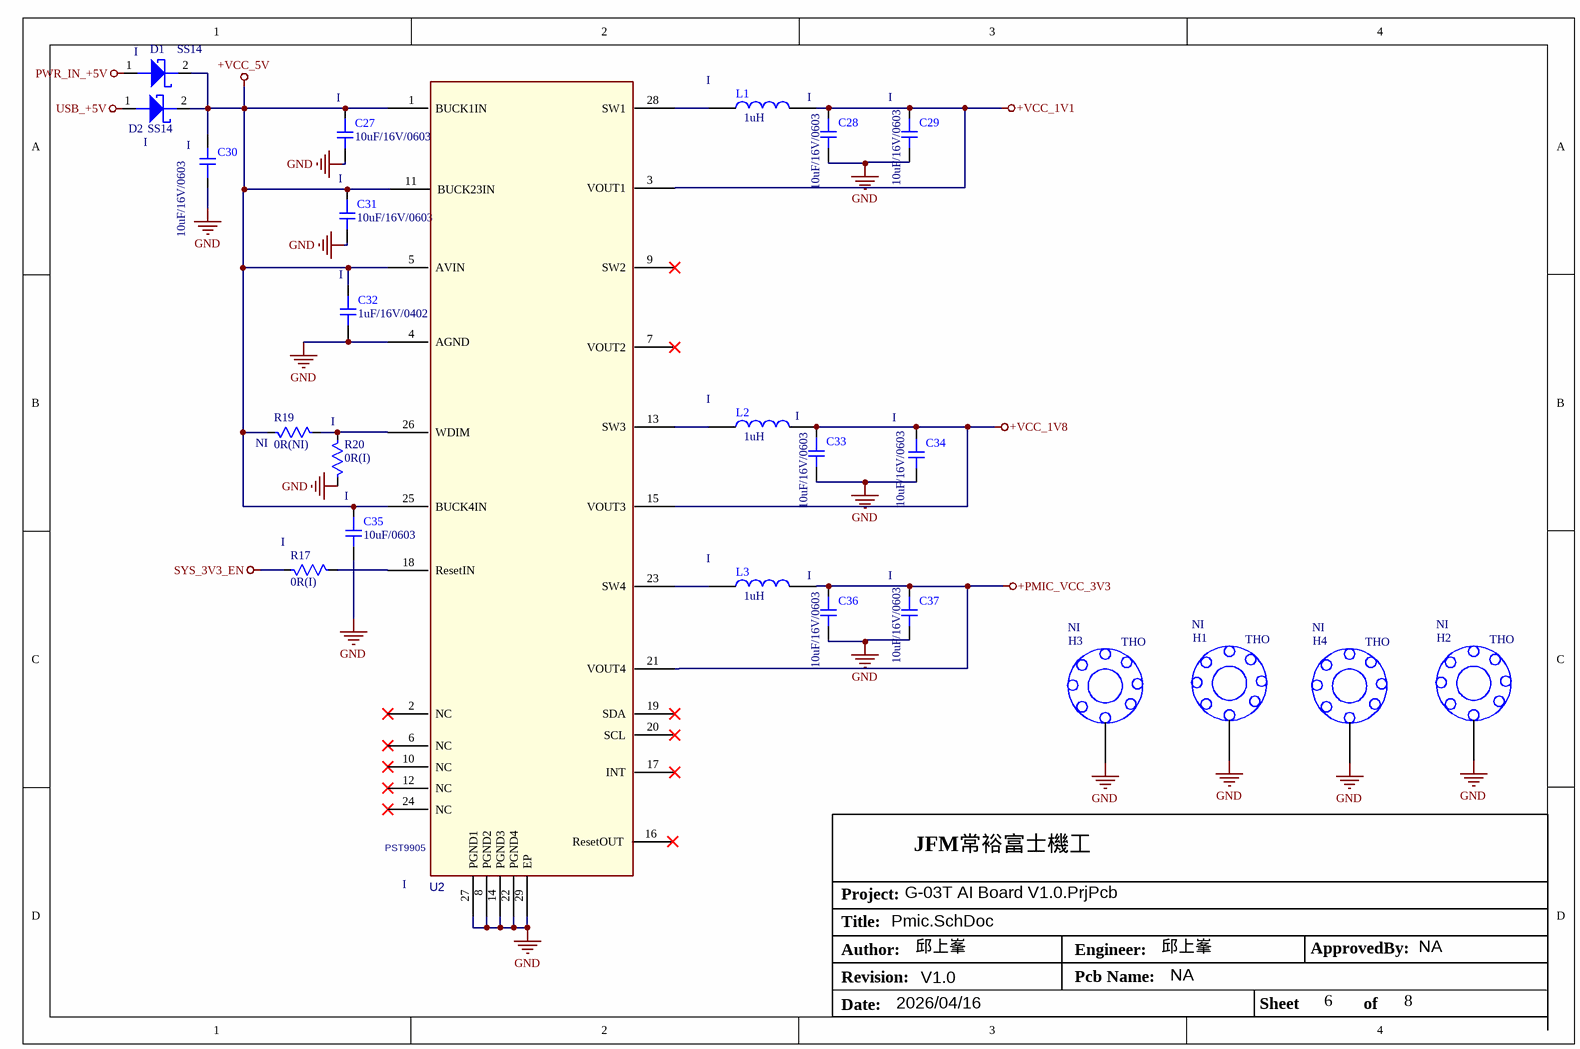
[diagram p6: Pmic.SchDoc]

### Parts
C27  10uF/16V/0603  BOM: I  [C0603]
C28  10uF/16V/0603  BOM: I  [C0603]
C29  10uF/16V/0603  BOM: I  [C0603]
C30  10uF/16V/0603  BOM: I  [C0603]
C31  10uF/16V/0603  BOM: I  [C0603]
C32  1uF/16V/0402  BOM: I  [C0402]
C33  10uF/16V/0603  BOM: I  [C0603]
C34  10uF/16V/0603  BOM: I  [C0603]
C35  10uF/0603  BOM: I  [C0603]
C36  10uF/16V/0603  BOM: I  [C0603]
C37  10uF/16V/0603  BOM: I  [C0603]
D1  SS14  BOM: I  [DO-214AC (SMA)]
D2  SS14  BOM: I  [DO-214AC (SMA)]
H1  THO  BOM: NI  [TPH-3.4mm]
H2  THO  BOM: NI  [TPH-3.4mm]
H3  THO  BOM: NI  [TPH-3.4mm]
H4  THO  BOM: NI  [TPH-3.4mm]
L1  1uH  BOM: I  [INDC2016X100N]
L2  1uH  BOM: I  [INDC2016X100N]
L3  1uH  BOM: I  [INDC2016X100N]
R17  0R(I)  BOM: I  [R0402]
R19  0R(NI)  BOM: NI  [R0402]
R20  0R(I)  BOM: I  [R0402]
U2  PST9905  BOM: I  [QFN 5X5 28PIN]

### Nets
+PMIC_VCC_3V3: C36.1 C37.1 L3.2 U2.21(VOUT4)
+VCC_1V1: C28.1 C29.1 L1.2 U2.3(VOUT1)  [project net V11]
+VCC_1V8: C33.1 C34.1 L2.2 U2.15(VOUT3)  [project net VDDR]
+VCC_5V: C27.1 C30.2 C31.1 C32.1 C35.1 D1.2(CATHODE) D2.2(CATHODE) R19.2 U2.1(BUCK1IN) U2.5(AVIN) U2.11(BUCK23IN) U2.25(BUCK4IN)
GND: C27.2 C28.2 C29.2 C30.1 C31.2 C32.2 C33.2 C34.2 C35.2 C36.2 C37.2 H1.0 H2.0 H3.0 H4.0 R20.1 U2.4(AGND) U2.8(PGND2) U2.14(PGND3) U2.22(PGND4) U2.27(PGND1) U2.29(EP)
PWR_IN_+5V: D1.1(ANODE)
SYS_3V3_EN: R17.2
USB_+5V: D2.1(ANODE)
NetL1_1: L1.1 U2.28(SW1)
NetL2_1: L2.1 U2.13(SW3)
NetL3_1: L3.1 U2.23(SW4)
NetR17_1: R17.1 U2.18(ResetIN)
NetR19_1: R19.1 R20.2 U2.26(WDIM)

Not connected (* = marked no-connect by the designer): U2 2(NC)* 6(NC)* 7(VOUT2)* 9(SW2)* 10(NC)* 12(NC)* 16(ResetOUT)* 17(INT)* 19(SDA)* 20(SCL)* 24(NC)*

### Notes on the sheet
- Title:
- Project:
- Date:
- Author:
- Revision:
- Engineer:
- Pcb Name:
- Sheet
- ApprovedBy:
- of

### Library data of the parts
C27-C37 = Cap
D1 D2 = DIODE SCHOTTKY: Schottky Diodes & Rectifiers 1A, 40V, Schottky Rectifier
L1-L3 = L: Code_IEC: 1005; Value: 10mH; Published: 8-Jun-2000; LatestRevisionDate: 29-May-2009; LatestRevisionNote: IPC-7351 Footprint Added.; PackageReference: 0402-A; Publisher: Altium Limited; PackageDescription: Chip Inductor; Code_JEITA: 0402
R17 R20 = Res: opt 0R
R19 = Res
U2 = PST9905: 4-Channel Power Management IC for Automotive System

## Sheet DC Converter.SchDoc
size A4; Date: 2026/04/16; ApprovedBy: NA; Author: 邱上峯; CompanyName: JFM常裕富士機工; Engineer: 邱上峯; Revision: V1.0; SheetNumber: 7; SheetTotal: 8; Pcb Name: NA
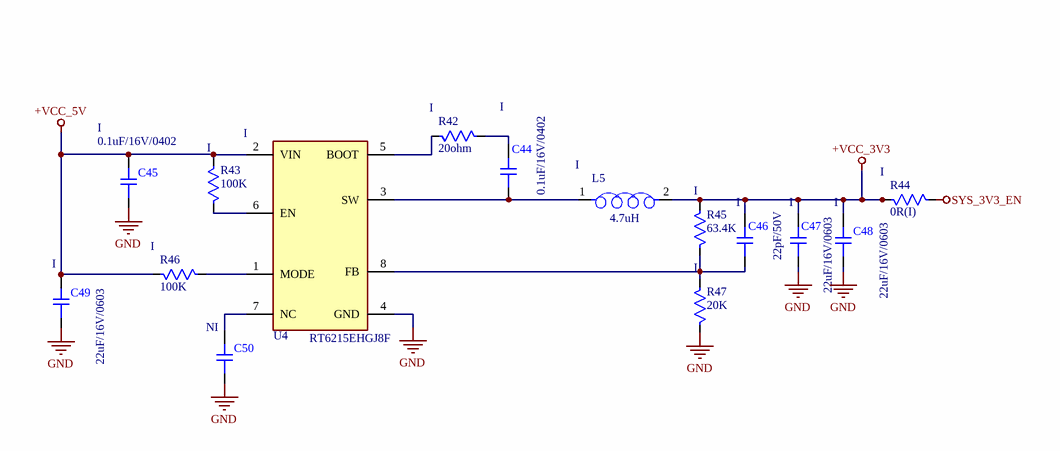
[diagram p7: DC Converter.SchDoc]

### Parts
C44  0.1uF/16V/0402  BOM: I  [C0402]
C45  0.1uF/16V/0402  BOM: I  [C0402]
C46  22pF/50V  BOM: I  [C0402]
C47  22uF/16V/0603  BOM: I  [C0603]
C48  22uF/16V/0603  BOM: I  [C0603]
C49  22uF/16V/0603  BOM: I  [C0603]
C50  NI  [C0402]
L5  4.7uH  BOM: I  [IND-HPI0402]
R42  20ohm  BOM: I  [R0402]
R43  100K  BOM: I  [R0402]
R44  0R(I)  BOM: I  [R0402]
R45  63.4K  BOM: I  [R0603]
R46  100K  BOM: I  [R0402]
R47  20K  BOM: I  [R0603]
U4  RT6215EHGJ8F  BOM: I  [SOT65P280X100-8N]

### Nets
+VCC_3V3: C46.2 C47.2 C48.2 L5.2 R44.1 R45.1
+VCC_5V: C45.2 C49.2 R43.2 R46.2 U4.2(VIN)
GND: C45.1 C47.1 C48.1 C49.1 C50.1 R47.2 U4.4(GND)
SYS_3V3_EN: R44.2
NetC44_1: C44.1 L5.1 U4.3(SW)
NetC44_2: C44.2 R42.1
NetC46_1: C46.1 R45.2 R47.1 U4.8(FB)
NetC50_2: C50.2 U4.7(NC)
NetR42_2: R42.2 U4.5(BOOT)
NetR43_1: R43.1 U4.6(EN)
NetR46_1: R46.1 U4.1(MODE)

### Notes on the sheet
- Title:
- Project:
- Date:
- Author:
- Revision:
- Engineer:
- Pcb Name:
- Sheet
- ApprovedBy:
- of

### Library data of the parts
C44-C49 = Cap
C50 = Cap: 3.9nF/16V; BOM: NI
L5 = INDUCTOR: 3L COILS/HPI0402-4R7M
R42-R47 = Res
U4 = RT6215EHGJ8F: DC/DC CONV, SYNC BUCK, 500KHZ, TSOT-23-8; Topology:Synchronous Buck (Step Down); Input Voltage Min:4.5V; Input Voltage Max:24V; No. of Outputs:1Outputs; DC / DC Converter IC Case:TSOT-23; No. of Pins:8Pins; Output Current:2A; Output RoHS Compliant: Yes; Manufacturer_Name: RICHTEK; Geometry.Height: 1mm; Mouser Part Number: *; Mouser Price/Stock: *; Manufacturer_Part_Number: RT6215EHGJ8F; Datasheet Link: https://componentsearchengine.com/Datasheets/2/RT6215EHGJ8F.pdf

## Sheet Change Note.SchDoc
size A4; SheetNumber: 8; SheetTotal: 8
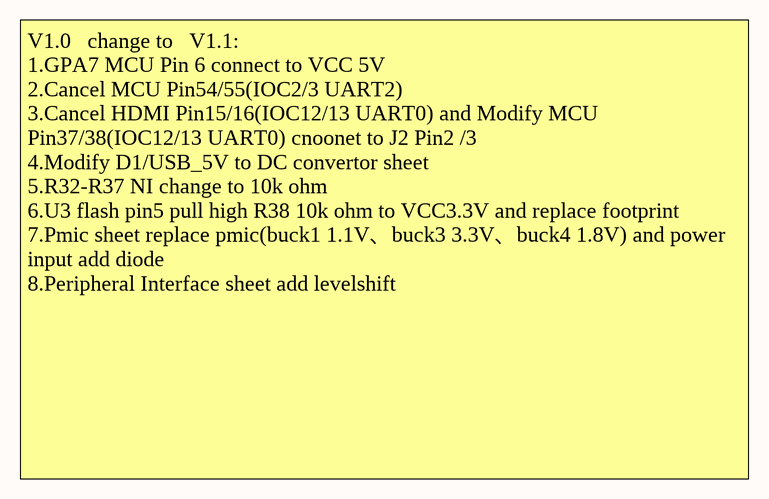
[diagram p8: Change Note.SchDoc]

### Notes on the sheet
- V1.0   change to   V1.1:
  1.GPA7 MCU Pin 6 connect to VCC 5V
  2.Cancel MCU Pin54/55(IOC2/3 UART2)
  3.Cancel HDMI Pin15/16(IOC12/13 UART0) and Modify MCU Pin37/38(IOC12/13 UART0) cnoonet to J2 Pin2 /3
  4.Modify D1/USB_5V to DC convertor sheet
  5.R32-R37 NI change to 10k ohm
  6.U3 flash pin5 pull high R38 10k ohm to VCC3.3V and replace footprint
  7.Pmic sheet replace pmic(buck1 1.1V、buck3 3.3V、buck4 1.8V) and power input add diode
  8.Peripheral Interface sheet add levelshift

## Nets that join several sheets
+VCC_3V3: CPU (15 pins), Peripheral Interface (8 pins), FLASH (6 pins), Micro SD-Card . USB2.0 (C40.2 CN1.4 R37.1), DC Converter (6 pins)
+VCC_5V: CPU (R27.2), Peripheral Interface (8 pins), Pmic (12 pins), DC Converter (5 pins)
GND: CPU (26 pins), Peripheral Interface (32 pins), FLASH (C38.1 U3.4), Micro SD-Card . USB2.0 (18 pins), Pmic (22 pins), DC Converter (7 pins)
ICE_3V3: Peripheral Interface (J1.22 R16.2), FLASH (R41.1)
LDO_SD30: CPU (C20.2 U1.88 U1.126), Micro SD-Card . USB2.0 (5 pins)
PWR_IN_+5V: Peripheral Interface (J2.1), Pmic (D1.1)
SYS_3V3_EN: Pmic (R17.2), DC Converter (R44.2)
USB_+5V: Micro SD-Card . USB2.0 (5 pins), Pmic (D2.1)
V11: CPU (10 pins), Peripheral Interface (FPC1.1), Pmic (C28.1 C29.1 L1.2 U2.3)
VCC_SEN_2V8: CPU (C21.2 U1.127), Peripheral Interface (FPC1.2)
VDDR: CPU (C14.2 C15.2 U1.84 U1.87), Peripheral Interface (FPC1.3 FPC1.8 R12.2), Pmic (C33.1 C34.1 L2.2 U2.15)
C_N: CPU (U1.101), Peripheral Interface (FPC1.18)
C_P: CPU (U1.100), Peripheral Interface (FPC1.17)
D0_N: CPU (U1.105), Peripheral Interface (FPC1.21)
D0_P: CPU (U1.104), Peripheral Interface (FPC1.20)
D1_N: CPU (U1.103), Peripheral Interface (FPC1.12)
D1_P: CPU (U1.102), Peripheral Interface (FPC1.11)
D2_N: CPU (U1.99), Peripheral Interface (FPC1.24)
D2_P: CPU (U1.98), Peripheral Interface (FPC1.23)
D3_N: CPU (U1.97), Peripheral Interface (FPC1.15)
D3_P: CPU (U1.96), Peripheral Interface (FPC1.14)
D_USB_A_N: CPU (U1.20), Micro SD-Card . USB2.0 (USB1.A7 USB1.B7)
D_USB_A_P: CPU (U1.21), Micro SD-Card . USB2.0 (USB1.A6 USB1.B6)
IOA2: CPU (U1.68), Peripheral Interface (FPC2.16)
IOA3: CPU (U1.69), Peripheral Interface (FPC2.15)
IOA4: CPU (U1.70), Peripheral Interface (FPC2.13)
IOA5: CPU (U1.71), Peripheral Interface (FPC2.12)
IOA6: CPU (U1.72), Peripheral Interface (FPC2.11)
IOA7: CPU (U1.73), Peripheral Interface (FPC2.10)
IOA8: CPU (U1.82), Micro SD-Card . USB2.0 (CN1.9 R37.2)
IOB3: CPU (U1.34), Peripheral Interface (R8.1 R9.2)
IOB4: CPU (U1.35), Peripheral Interface (FPC1.5 R11.1)
IOB5: CPU (U1.36), Peripheral Interface (FPC1.6 R10.1)
IOB6: CPU (U1.22), Peripheral Interface (J1.10)
IOB7: CPU (U1.23), Peripheral Interface (J1.8)
IOB10: CPU (U1.93), Micro SD-Card . USB2.0 (CN1.2 R34.2)
IOB11: CPU (U1.90), Micro SD-Card . USB2.0 (CN1.7 R35.2)
IOB12: CPU (U1.89), Micro SD-Card . USB2.0 (CN1.8 R33.2)
IOB13: CPU (U1.94), Micro SD-Card . USB2.0 (CN1.1 R32.2)
IOB14: CPU (U1.92), Micro SD-Card . USB2.0 (CN1.3 R36.2)
IOB15: CPU (U1.91), Micro SD-Card . USB2.0 (R26.1)
IOC12: CPU (U1.37), Peripheral Interface (Q1.2 R30.2 R39.1)
IOC13: CPU (U1.38), Peripheral Interface (Q2.2 R31.2 R40.1)
IOC14: CPU (U1.39), Peripheral Interface (J1.16 R15.2)
IOC15: CPU (U1.40), Peripheral Interface (J1.18 R14.2)
IOD0: CPU (U1.114), FLASH (R21.1 U3.1)
IOD1: CPU (U1.113), FLASH (R41.2 U3.6)
IOD2: CPU (U1.112), FLASH (R38.2 U3.5)
IOD3: CPU (U1.111), FLASH (U3.2)
IOD4: CPU (U1.110), FLASH (R22.1 U3.3)
IOD5: CPU (U1.109), FLASH (R23.2 U3.7)
IOD6: CPU (U1.29), Peripheral Interface (J1.7)
IOD7: CPU (R7.1 U1.28), Peripheral Interface (FPC1.9)
IOD8: CPU (U1.27), Peripheral Interface (J1.3)
IOD9: CPU (U1.26), Peripheral Interface (J1.1)
IOD10: CPU (U1.78), Peripheral Interface (FPC2.5)
IOD11: CPU (S1.1 U1.77), Peripheral Interface (FPC2.6)
IOD12: CPU (U1.79), Peripheral Interface (FPC2.4)
IOD13: CPU (U1.76), Peripheral Interface (FPC2.7)
IOD14: CPU (U1.75), Peripheral Interface (FPC2.8)
IOD15: CPU (U1.80), Peripheral Interface (FPC2.3)
IOF8: CPU (U1.83), Peripheral Interface (HDMI1.14)
IOF_0_N: CPU (U1.47), Peripheral Interface (HDMI1.9)
IOF_0_P: CPU (U1.46), Peripheral Interface (HDMI1.8)
IOF_1_N: CPU (U1.45), Peripheral Interface (HDMI1.6)
IOF_1_P: CPU (U1.44), Peripheral Interface (HDMI1.5)
IOF_2_N: CPU (U1.43), Peripheral Interface (HDMI1.3)
IOF_2_P: CPU (U1.42), Peripheral Interface (HDMI1.2)
IOF_C_N: CPU (U1.49), Peripheral Interface (HDMI1.12)
IOF_C_P: CPU (U1.48), Peripheral Interface (HDMI1.11)
RESET: CPU (C25.1 U1.50), Peripheral Interface (J1.14)
SPI0_CLK: CPU (R7.2), Peripheral Interface (J1.5)